# EAGLE design untitled (EAGLE 9.0.0)
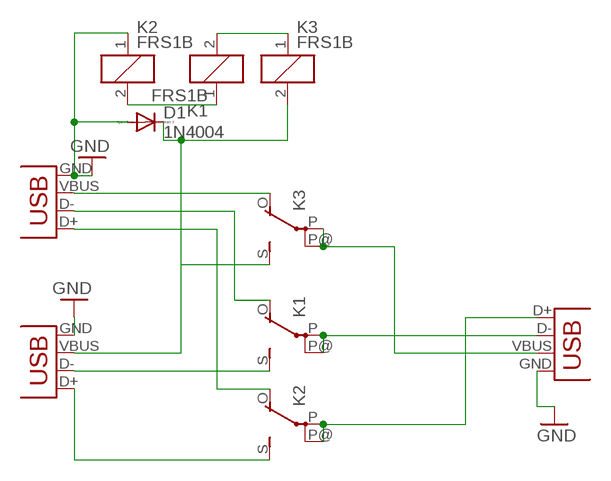
[diagram p0: schematic, sheet 1]

## Parts
D1  1N4004  [DO41-10]
K1  FRS1B  [FRS1B]
K2  FRS1B  [FRS1B]
K3  FRS1B  [FRS1B]
X1  USB-B-H  [USB-B-H]
X2  USB-A-H  [USB-A-H]
X3  USB-A-H  [USB-A-H]

## Nets
GND: D1.A K2.1 X1.GND X2.GND X3.GND
N$1: K3.P(2:P) K3.P@(2:P) X3.VBUS
N$2: K1.P(2:P) K1.P@(2:P) X3.D-
N$3: K1.S(2:S) X1.D-
N$4: K2.P(2:P) K2.P@(2:P) X3.D+
N$5: K2.S(2:S) X1.D+
N$6: K2.O(2:O) X2.D+
N$7: K1.O(2:O) X2.D-
N$8: D1.C K3.2 K3.S(2:S) X1.VBUS
N$9: K3.O(2:O) X2.VBUS
N$10: K1.1 K2.2
N$11: K1.2 K3.1

## Library data of the parts
D1 = diode:1N4004: DIODE general purpose rectifier, 1 A
K1-K3 = relay:FRS1B: RELAY 1 x switch, same as V23101-D6-A201, Siemens; OC_FARNELL: unknown; OC_NEWARK: unknown
X1-X3 = con-usb:USB: USB Connectors

## Board
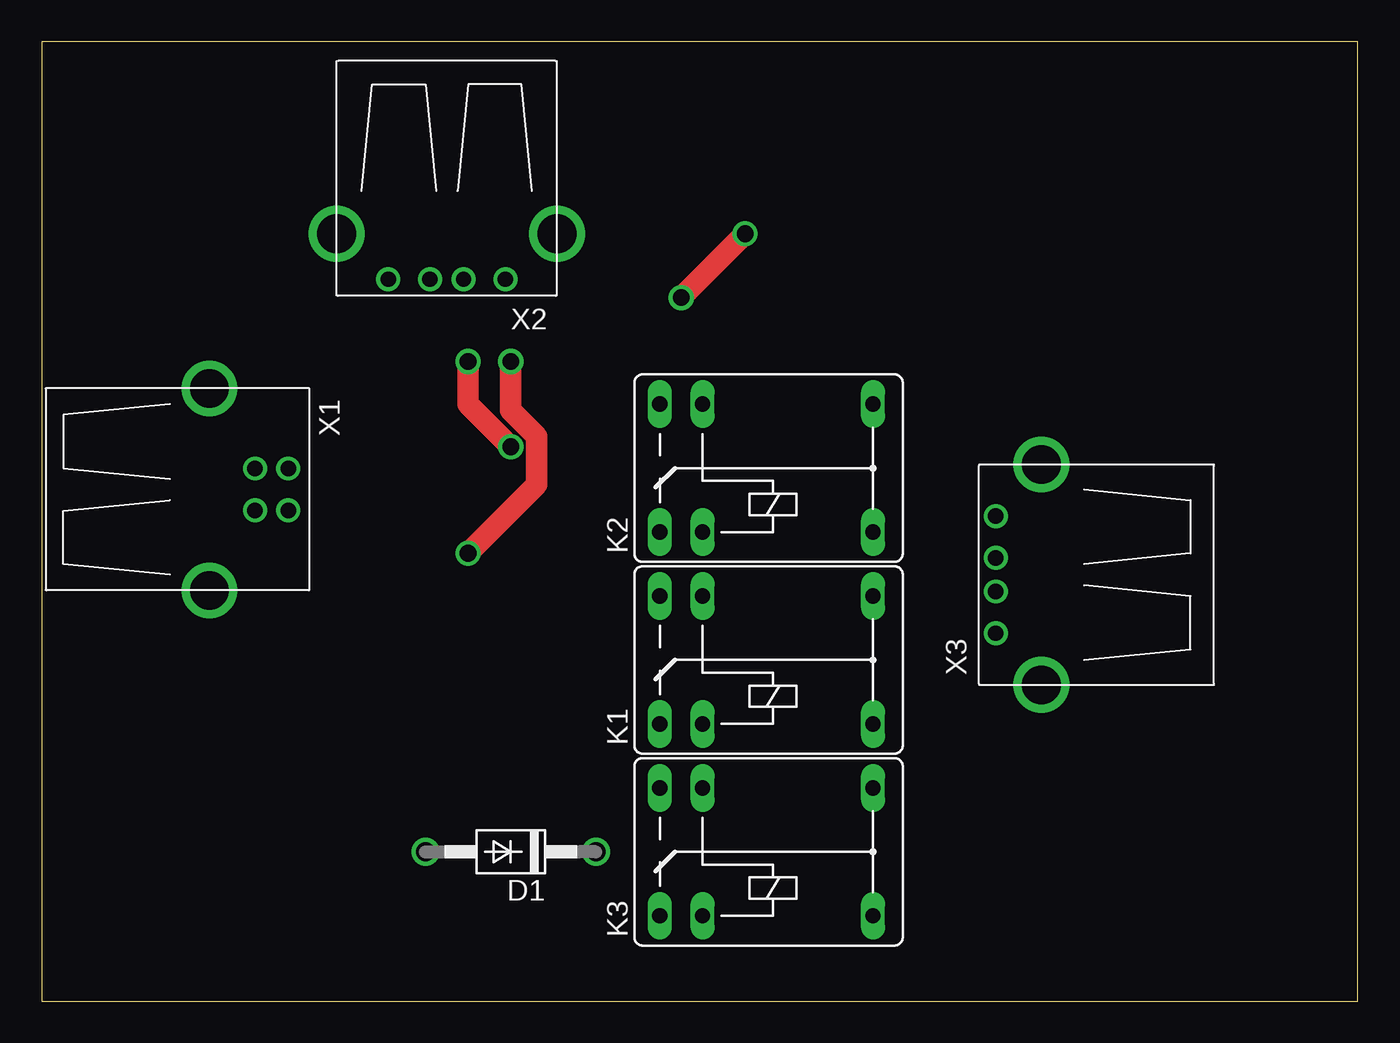
[diagram p1: board, top side]
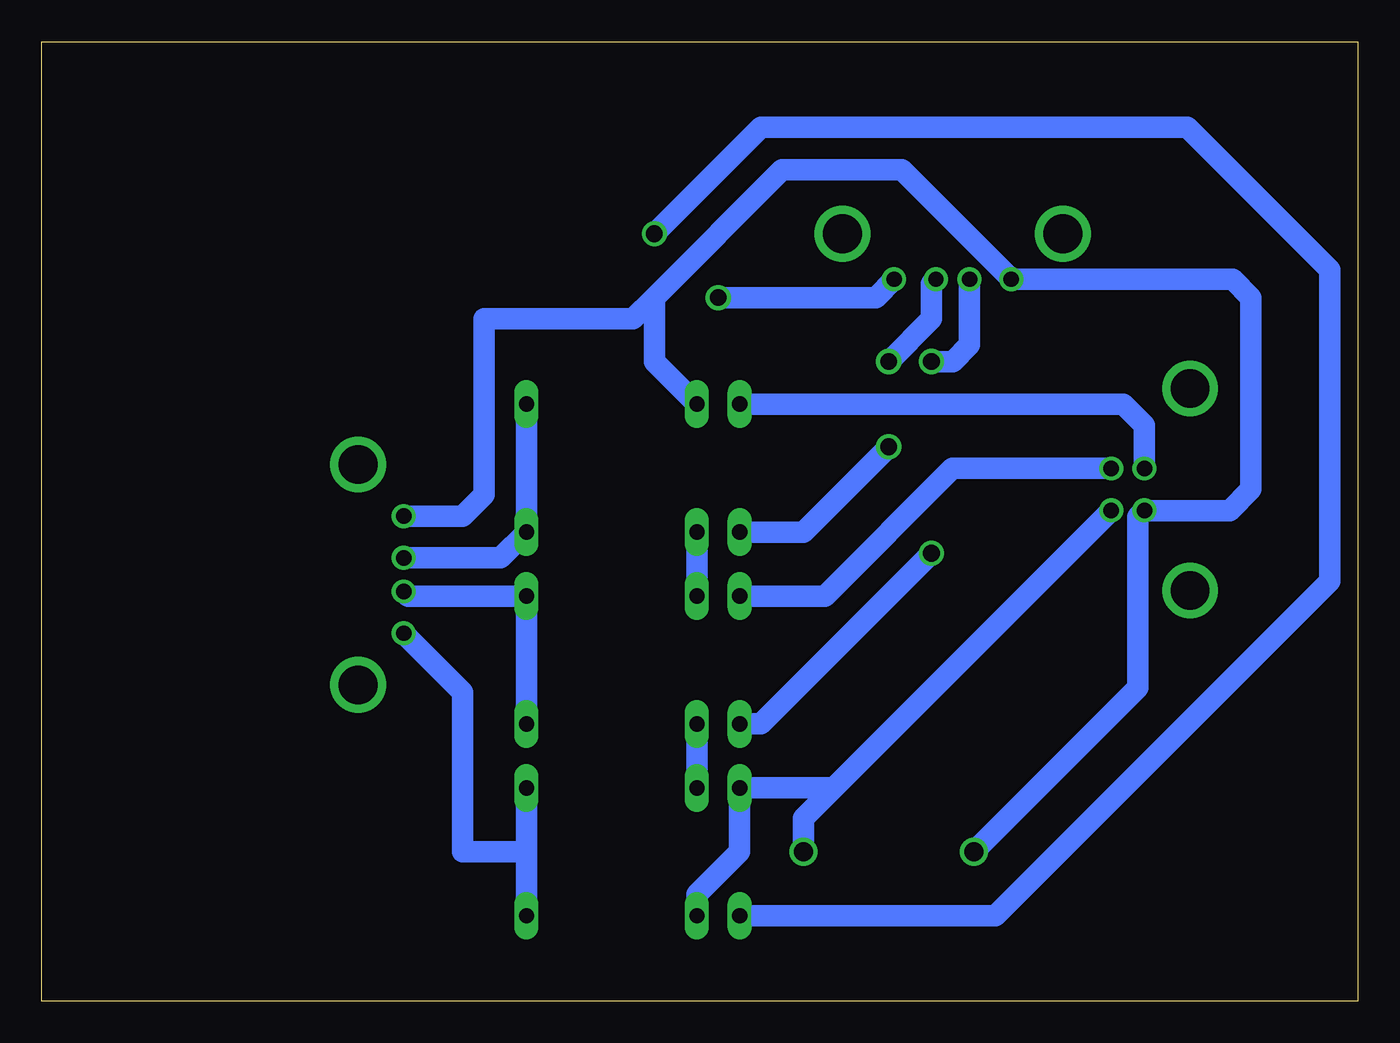
[diagram p2: board, bottom side, seen from below]

Size 78.41 x 57.14 mm. Coordinates in mm from the lower left corner, seen from the top.
Outline: 0,0 78.41,0 78.41,57.14 0,57.14 0,0
Copper layers (1*16): Top 0.035mm / dielectric 1.5mm / Bottom 0.035mm
Design rules "default": minimum track width 6mil, minimum drill 0.35mm, track to track 6mil, track to pad 6mil, pad to pad 6mil, via to via 6mil, smd to smd 6mil, copper to edge 40mil, drill to drill 6mil, minimum pad ring 10mil, minimum via ring 8mil, stop-mask expansion 4mil, vias tented up to drill 0mil, thermal gap 10mil

### Footprints (pad centres in the part's own frame; a part is rotated, then mirrored left to right if it is on the bottom)
DO41-10 = drill 1.118: A 5.08,0; C -5.08,0
FRS1B = drill 0.914 long: 1 0,3.81; 2 0,-3.81; O -2.54,-3.81; P 10.16,3.81; P@ 10.16,-3.81; S -2.54,3.81
USB-B-H = drill 0.914: D+ 0,1.25; D- 1.981,1.25; GND 0,-1.25; VBUS 1.981,-1.25 | drill 2.286: P$1 -2.718,-6.02; P$2 -2.718,6.02
USB-A-H = drill 0.914: D+ 2.718,-1.003; D- 2.718,1.003; GND 2.718,-3.493; VBUS 2.718,3.493 | drill 2.311: P$5 0,-6.566; P$6 0,6.566

### Placement (x,y rotation side)
D1  27.94,8.89 180 top
K1  39.37,20.32 0 top
K2  39.37,31.75 0 top
K3  39.37,8.89 0 top
X1  12.7,30.48 0 top
X2  24.13,45.72 270 top
X3  59.56,25.4 180 top

### Tracks (layer width: path | path; a pad name or v marks a point on that pad's centre or on a via)
GND
  Bottom 1.27: X3.GND 53.34,28.89 52.07,30.16 52.07,40.64 43.18,40.64 41.91,41.91 | 41.91,41.91 34.29,49.53 27.16,49.53 X2.GND 7.44,43 6.35,41.91 6.35,30.48 7.62,29.21 12.68,29.21 X1.GND 13.08,28.85 13.08,18.67 D1.A | K2.1 41.91,38.1 41.91,41.91
N$1
  Bottom 1.27: K3.P 49.53,8.89 | 49.53,8.89 K3.P@ | 49.53,8.89 53.34,8.89 53.34,18.4 X3.VBUS
N$2
  Bottom 1.27: K1.P@ K1.P 56.58,24.13 X3.D-
N$3
  Bottom 1.27: X1.D- 24.15,31.73 31.75,24.13 K1.S
N$4
  Bottom 1.27: K2.P K2.P@ 51.07,26.4 X3.D+
N$5
  Bottom 1.27: X1.D+ 12.7,34.29 13.97,35.56 K2.S
N$6  (via drill 1)
  Top 1.27: v25.4,38.1 25.4,35.56 v27.94,33.02
  Bottom 1.27: v27.94,33.02 33.02,27.94 K2.O | X2.D+ 23.13,39.1 24.13,38.1 v25.4,38.1
N$7  (via drill 1)
  Top 1.27: v27.94,38.1 27.94,35.19 29.48,33.66 29.48,30.75 v25.4,26.67
  Bottom 1.27: X2.D- 25.4,42.74 25.4,40.64 v27.94,38.1 | v25.4,26.67 35.56,16.51 K1.O
N$8
  Bottom 1.27: X1.VBUS 31.21,12.7 | 31.21,12.7 K3.S 36.83,8.89 39.37,6.35 K3.2 | 31.21,12.7 33.02,10.89 D1.C
N$9  (via drill 1)
  Top 1.27: v38.1,41.91 v41.91,45.72
  Bottom 1.27: K3.O 21.59,5.08 1.65,25.02 1.65,43.56 10.16,52.07 35.56,52.07 v41.91,45.72 | X2.VBUS 28.71,41.91 v38.1,41.91
N$10
  Bottom 1.27: K2.2 K1.1
N$11
  Bottom 1.27: K1.2 K3.1